# Altium schematic sheet Main System.SchDoc
size A4
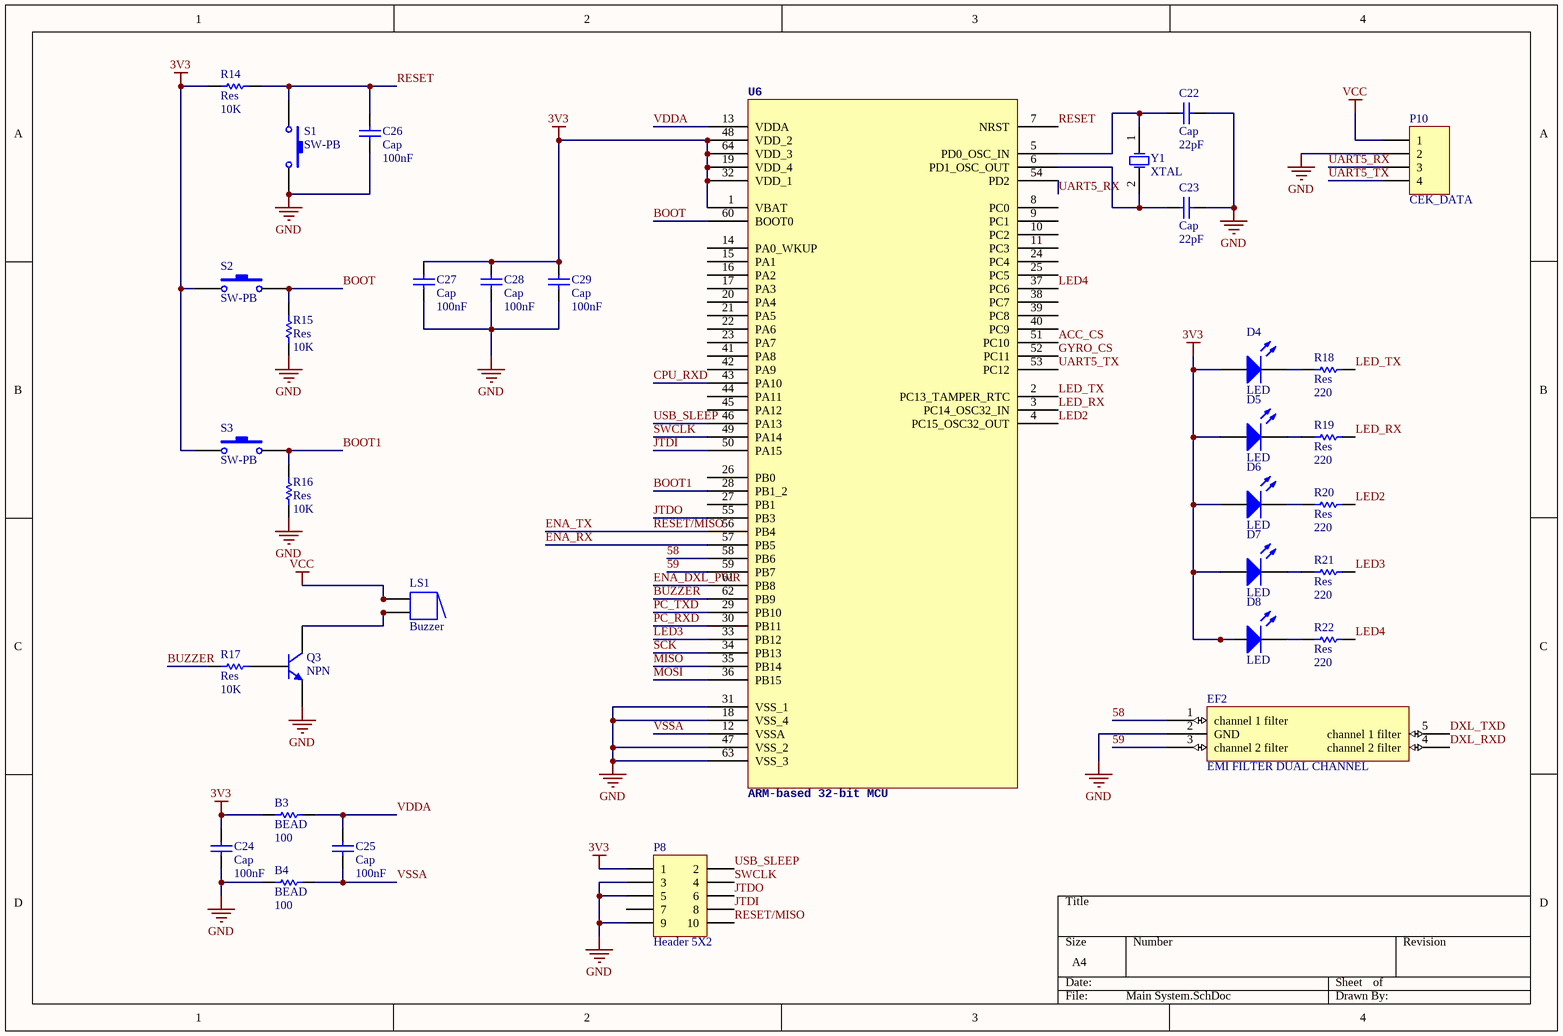
[diagram p0: Main System.SchDoc]

## Parts
B3  BEAD  value 100  [0603-RES]
B4  BEAD  value 100  [0603-RES]
C22  Cap  value 22pF  [0603-CAP]
C23  Cap  value 22pF  [0603-CAP]
C24  Cap  value 100nF  [0603-CAP]
C25  Cap  value 100nF  [0603-CAP]
C26  Cap  value 100nF  [0603-CAP]
C27  Cap  value 100nF  [0603-CAP]
C28  Cap  value 100nF  [0603-CAP]
C29  Cap  value 100nF  [0603-CAP]
D4  LED  [CHIPLED_0603]
D5  LED  [CHIPLED_0603]
D6  LED  [CHIPLED_0603]
D7  LED  [CHIPLED_0603]
D8  LED  [CHIPLED_0603]
EF2  EMI FILTER DUAL CHANNEL  [Emi Filter Dual Channel SOTFL]
LS1  Buzzer  [ABSM-1574]
P8  Header 5X2  [HDR2X5]
P10  CEK_DATA  [HDR1X4]
Q3  NPN  [SOT23]
R14  Res  value 10K  [0603-RES]
R15  Res  value 10K  [0603-RES]
R16  Res  value 10K  [0603-RES]
R17  Res  value 10K  [0603-RES]
R18  Res  value 220  [0603-RES]
R19  Res  value 220  [0603-RES]
R20  Res  value 220  [0603-RES]
R21  Res  value 220  [0603-RES]
R22  Res  value 220  [0603-RES]
S1  SW-PB  [TACTILE-SWITCH-SMD]
S2  SW-PB  [TACTILE-SWITCH-SMD]
S3  SW-PB  [TACTILE-SWITCH-SMD]
U6  ARM-based 32-bit MCU  [QFP-64N]
Y1  XTAL  [HC49US]

## Nets
3V3: B3.2 C24.2 C27.2 C28.2 C29.2 D4.1(A) D5.1(A) D6.1(A) D7.1(A) D8.1(A) P8.1 R14.1 S2.1 S3.1 U6.1(VBAT) U6.19(VDD_4) U6.32(VDD_1) U6.48(VDD_2) U6.64(VDD_3)
GND: B4.2 C22.2 C23.2 C24.1 C26.1 C27.1 C28.1 C29.1 EF2.2(GND) P8.3 P8.5 P8.9 P10.2 Q3.2(E) R15.1 R16.1 S1.3 U6.18(VSS_4) U6.31(VSS_1) U6.47(VSS_2) U6.63(VSS_3)
VCC: LS1.1 LS1.1A P10.1
58: EF2.1(channel_1_filter) U6.58(PB6)
59: EF2.3(channel_2_filter) U6.59(PB7)
ACC_CS: U6.51(PC10)
BOOT: R15.2 S2.3 U6.60(BOOT0)
BOOT1: R16.2 S3.3 U6.28(PB1_2)
BUZZER: R17.2 U6.62(PB9)
CPU_RXD: U6.43(PA10)
DXL_RXD: EF2.4(channel_2_filter)
DXL_TXD: EF2.5(channel_1_filter)
ENA_DXL_PWR: U6.61(PB8)
ENA_RX: U6.57(PB5)
ENA_TX: P8.10 U6.56(PB4)  [also labelled RESET/MISO]
GYRO_CS: U6.52(PC11)
JTDI: P8.8 U6.50(PA15)
JTDO: P8.6 U6.55(PB3)
LED2: R20.1 U6.4(PC15_OSC32_OUT)
LED3: R21.1 U6.33(PB12)
LED4: R22.1 U6.37(PC6)
LED_RX: R19.1 U6.3(PC14_OSC32_IN)
LED_TX: R18.1 U6.2(PC13_TAMPER_RTC)
MISO: U6.35(PB14)
MOSI: U6.36(PB15)
PC_RXD: U6.30(PB11)
PC_TXD: U6.29(PB10)
RESET: C26.2 R14.2 S1.1 U6.7(NRST)
SCK: U6.34(PB13)
SWCLK: P8.4 U6.49(PA14)
UART5_RX: P10.3 U6.54(PD2)
UART5_TX: P10.4 U6.53(PC12)
USB_SLEEP: P8.2 U6.46(PA13)
VDDA: B3.1 C25.2 U6.13(VDDA)
VSSA: B4.1 C25.1 U6.12(VSSA)
NetC22_1: C22.1 U6.5(PD0_OSC_IN) Y1.1(OSC1)
NetC23_1: C23.1 U6.6(PD1_OSC_OUT) Y1.2(OSC2)
NetD4_2: D4.2(K) R18.2
NetD5_2: D5.2(K) R19.2
NetD6_2: D6.2(K) R20.2
NetD7_2: D7.2(K) R21.2
NetD8_2: D8.2(K) R22.2
NetLS1_2: LS1.2 LS1.2A Q3.3(C)
NetQ3_1: Q3.1(B) R17.1

Not connected (* = marked no-connect by the designer): P8 7; U6 8(PC0) 9(PC1) 10(PC2) 11(PC3) 14(PA0_WKUP) 15(PA1) 16(PA2) 17(PA3) 20(PA4) 21(PA5) 22(PA6) 23(PA7) 24(PC4) 25(PC5) 26(PB0) 27(PB1) 38(PC7) 39(PC8) 40(PC9) 41(PA8) 42(PA9) 44(PA11) 45(PA12)

## Library data of the parts
B3 B4 R14-R22 = Res: Resistor; Published: 8-Jun-2000; LatestRevisionDate: 17-Jul-2002; LatestRevisionNote: Re-released for DXP Platform.; PackageReference: AXIAL-0.3; Publisher: Altium Limited; PackageDescription: Axial Device, Thru-Hole; 2 Leads; 0.3 in Pin Spacing
C22-C29 = Cap: Capacitor; Published: 8-Jun-2000; LatestRevisionDate: 17-Jul-2002; LatestRevisionNote: Re-released for DXP Platform.; PackageReference: RAD-0.3; Publisher: Altium Limited; PackageDescription: Radial Cap, Thru-Hole; 2 Leads; 0.3 in Pin Spacing
D4-D8 = LED: Typical INFRARED GaAs LED; Published: 8-Jun-2000; LatestRevisionDate: 08-Jul-2005; LatestRevisionNote: Mech Layer 1 removed.; PackageReference: LED-0; Publisher: Altium Limited; PackageDescription: LED; 2 Leads
LS1 = Buzzer: Magnetic Transducer Buzzer; Published: 24-Mar-1999; LatestRevisionDate: 17-Dec-2003; LatestRevisionNote: Schematic revised, PCB Footprint replaced.; DatasheetVersion: 17-Dec-2003; PackageReference: ABSM-1574; Publisher: Altium Limited; PackageDescription: Magnetic Transducer Buzzer; ComponentLink1Description: Manufacturer Link; ComponentLink1URL: http://www.megastar.com/linecard/buzzmode/index.php
P8 = Header 5X2: Header, 5-Pin, Dual row; LatestRevisionDate: 17-Jul-2002; LatestRevisionNote: Re-released for DXP Platform.; Publisher: Altium Limited
P10 = Header 4: Header, 4-Pin; LatestRevisionDate: 17-Jul-2002; LatestRevisionNote: Re-released for DXP Platform.; Publisher: Altium Limited
Q3 = NPN: NPN Bipolar Transistor; Published: 8-Jun-2000; LatestRevisionDate: 17-Jul-2002; LatestRevisionNote: Re-released for DXP Platform.; PackageReference: TO-226-AA; Publisher: Altium Limited; PackageDescription: TO, Flat Index; 3 In-Line, Axial Leads; Body Dia. 4.8mm; Leads 0.55 x 0.51 mm (max); Code_JEDEC: TO-226-AA
S1-S3 = SW-PB: Switch; Published: 24-Mar-1999; LatestRevisionDate: 17-Jul-2002; LatestRevisionNote: Re-released for DXP Platform.; PackageReference: SPST-2; Publisher: Altium Limited; PackageDescription: Switch; 2 Leads
U6 = STM32F103RET6: MPN: STM32F103RET6; OC_FARNELL: 1624138; OC_NEWARK: 01P4101; PACKAGE: QFP-64; SUPPLIER: STMICROELECTRONICS
Y1 = XTAL: Crystal Oscillator; Published: 8-Jun-2000; LatestRevisionDate: 17-Jul-2002; LatestRevisionNote: Re-released for DXP Platform.; PackageReference: R38; Publisher: Altium Limited; PackageDescription: Crystal, Thru-Hole; 2 Leads; Body 3.1 x 8.2 mm (Dia.xH)